# Altium schematic sheet Sensor_LM35_Package.SchDoc
size 127 x 114 mm
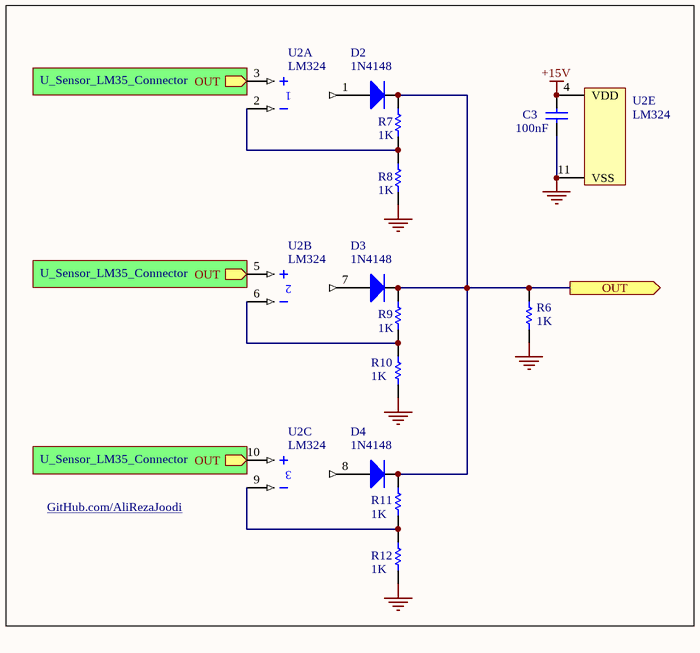
[diagram p0: Sensor_LM35_Package.SchDoc]

## Parts
C3  100nF  [CAPNTO2.54-3.05x1.78A]
D2  1N4148  [DIODE0.4_Glass]
D3  1N4148  [DIODE0.4_Glass]
D4  1N4148  [DIODE0.4_Glass]
R6  1K  [AXIAL-0.4]
R7  1K  [AXIAL-0.4]
R8  1K  [AXIAL-0.4]
R9  1K  [AXIAL-0.4]
R10  1K  [AXIAL-0.4]
R11  1K  [AXIAL-0.4]
R12  1K  [AXIAL-0.4]
U2  LM324  [646-06]  (parts A,B,C,E of 5)

## Sub-sheets
U_Sensor_LM35_Connector = Sensor_LM35_Connector.SchDoc: OUT (out)
U_Sensor_LM35_Connector = Sensor_LM35_Connector.SchDoc: OUT (out)
U_Sensor_LM35_Connector = Sensor_LM35_Connector.SchDoc: OUT (out)

## Ports
OUT (out)

## Nets
+15V: C3.2 U2.4(VDD)
GND: C3.1 R6.2 R8.1 R10.1 R12.1 U2.11(VSS)
OUT: D2.2(K) D3.2(K) D4.2(K) R6.1 R7.2 R9.2 R11.2 ; port OUT
NetD2_1: D2.1(A) U2.1(OUT)
NetD3_1: D3.1(A) U2.7(OUT)
NetD4_1: D4.1(A) U2.8(OUT)
NetR7_1: R7.1 R8.2 U2.2(IN-)
NetR9_1: R9.1 R10.2 U2.6(IN-)
NetR11_1: R11.1 R12.2 U2.9(IN-)
NetU2_3: U2.3(IN+) ; sheet U_Sensor_LM35_Connector/OUT
NetU2_5: U2.5(IN+) ; sheet U_Sensor_LM35_Connector/OUT
NetU2_10: U2.10(IN+) ; sheet U_Sensor_LM35_Connector/OUT

## Notes on the sheet
- GitHub.com/AliRezaJoodi

## Library data of the parts
C3 = Cap: Capacitor; Manufacturer: Generic Components; Class I: Passive; Published: 8-Jun-2000; Revision: July-2002: Re-released for DXP Platform.; Publisher: Altium Limited; Class II: Capacitor
D2-D4 = Diode: Default Diode; Manufacturer: Generic Components; Class I: Discrete; Class II: Diode - Switching; Published: 8-Jun-2000; Revision: July-2002: Re-released for DXP Platform.; Publisher: Altium Limited
R6-R12 = Res1: Resistor; Published: 8-Jun-2000; LatestRevisionDate: 17-Jul-2002; LatestRevisionNote: Re-released for DXP Platform.; PackageReference: AXIAL-0.3; Publisher: Altium Limited
U2 = LM324: Quad Low-Power Operational Amplifier; Published: 17-Jul-2002; LatestRevisionDate: 06-Jun-2005; LatestRevisionNote: Stylized 3D Model Added.; DatasheetVersion: 1988; PackageVersion: 1997; PackageReference: 646-06; Publisher: Altium Limited; PackageDescription: DIP; 14 Leads; Row Spacing 7.62 mm; Pitch 2.54 mm; ComponentLink1Description: Manufacturer Link; ComponentLink1URL: http://www.onsemi.com/site/products/parametrics/0,4446,251,00.html; ComponentLink2Description: Datasheet; ComponentLink2URL: http://www.onsemi.com/pub/Collateral/LM324-D.PDF